# EAGLE schematic bat-board rev 2.1 (EAGLE 9.0.1)
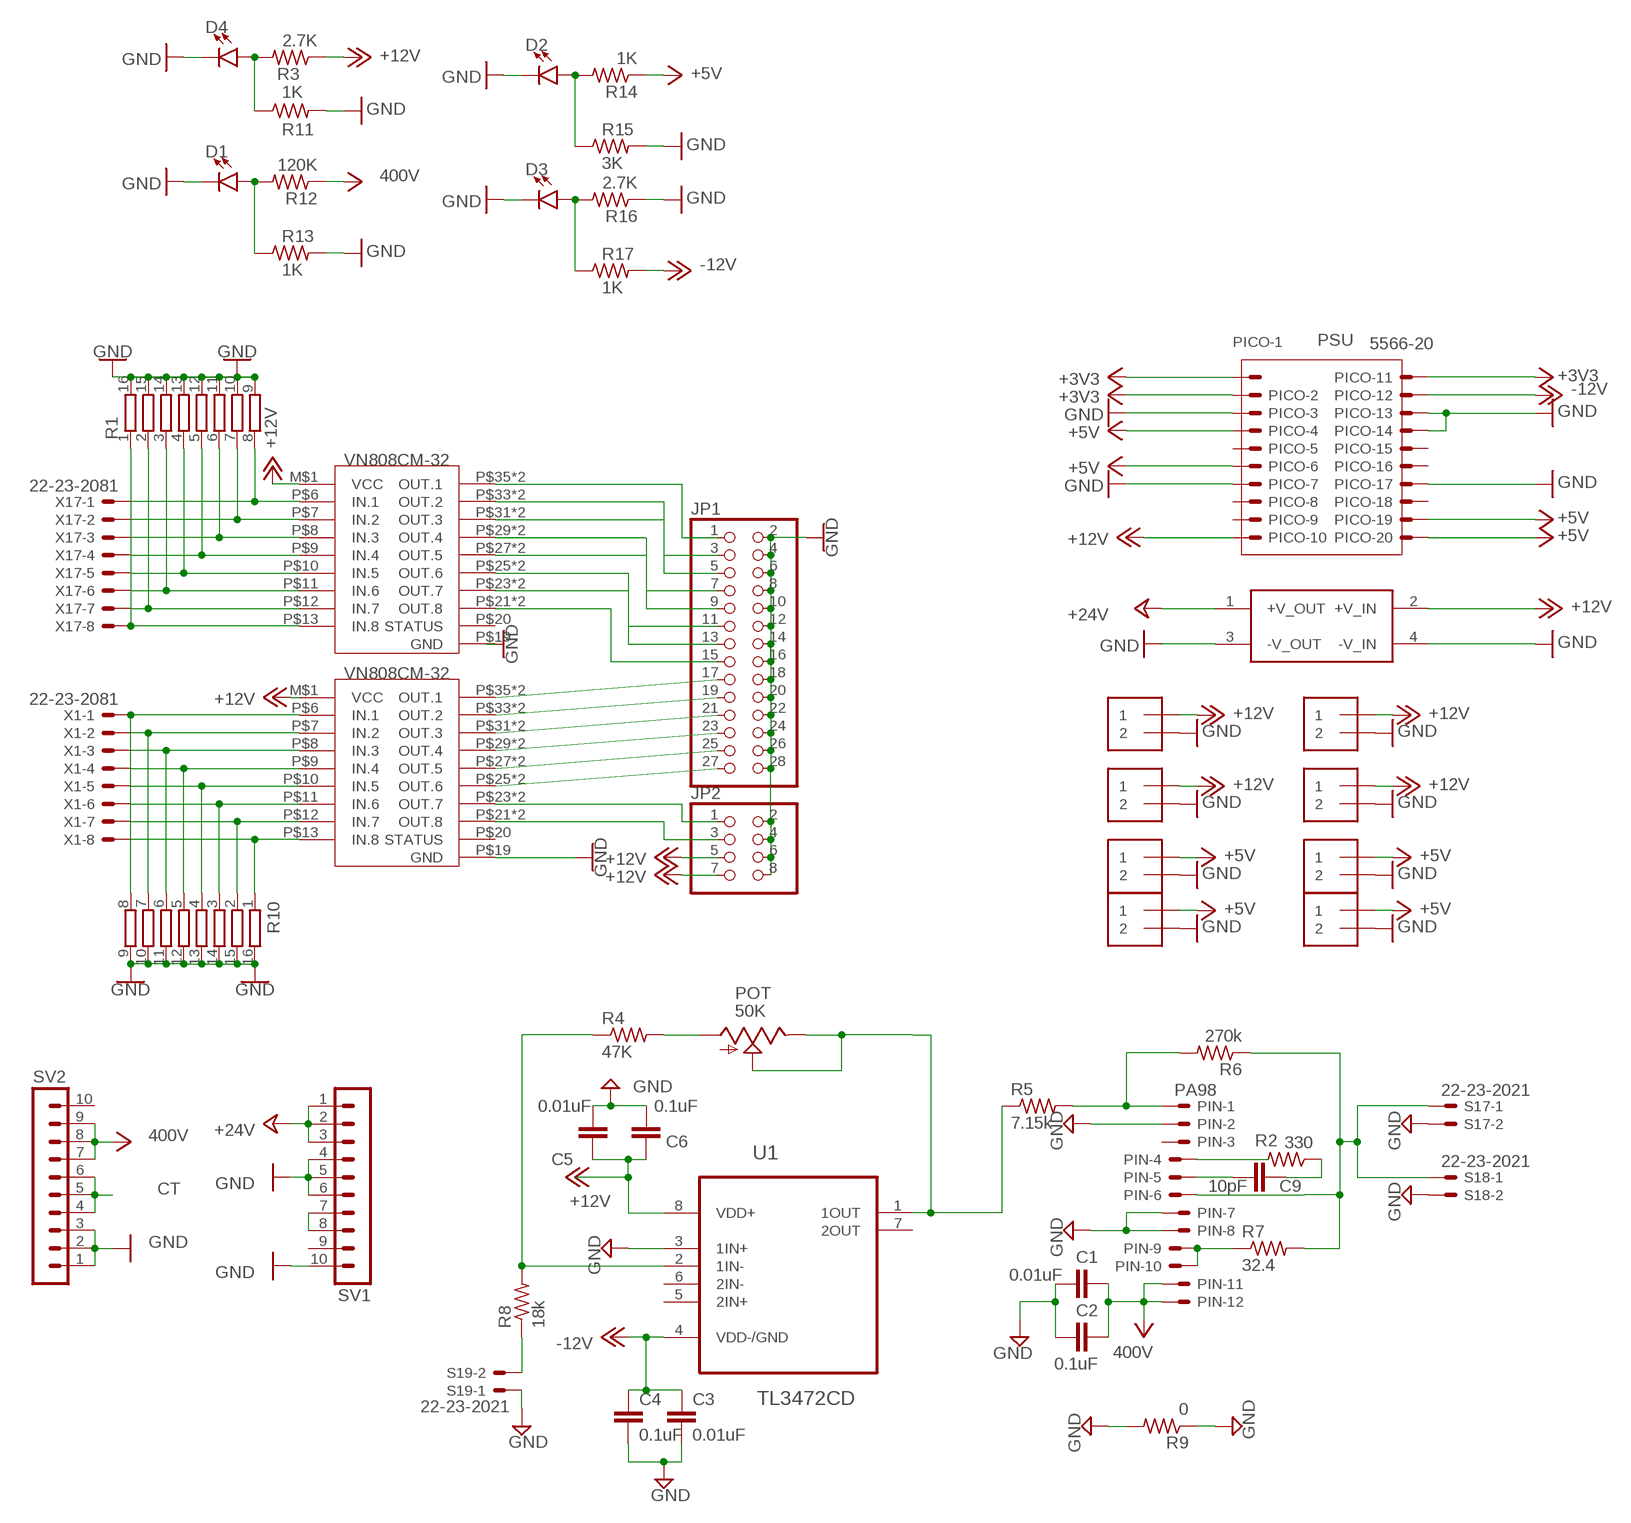
[diagram p0: schematic, sheet 1]

## Parts
$ZX1  12_DC-24_DC  [12_DC-24_DC]
C1  0.01uF  1.0UF-1206-50V-10%  [1206]
C2  0.1uF  1.0UF-1206-50V-10%  [1206]
C3  0.01uF  1.0UF-1206-50V-10%  [1206]
C4  0.1uF  1.0UF-1206-50V-10%  [1206]
C5  0.01uF  1.0UF-1206-50V-10%  [1206]
C6  0.1uF  1.0UF-1206-50V-10%  [1206]
C9  10pF  1.0UF-1206-50V-10%  [1206]
D1  LED1206  [LED-1206]
D2  LED1206  [LED-1206]
D3  LED1206  [LED-1206]
D4  LED1206  [LED-1206]
J1  1X2-3.5MM  [1X2-3.5MM]
J2  1X2-3.5MM  [1X2-3.5MM]
J3  1X2-3.5MM  [1X2-3.5MM]
J4  1X2-3.5MM  [1X2-3.5MM]
J5  1X2-3.5MM  [1X2-3.5MM]
J6  1X2-3.5MM  [1X2-3.5MM]
J7  1X2-3.5MM  [1X2-3.5MM]
J8  1X2-3.5MM  [1X2-3.5MM]
JP1  PINHD-2X14-CB  [2X14-CLEANBIG]
JP2  PINHD-2X4  [2X04]
PICO  5566-20  [5566-20]
PIN  PA98  22-23-2121  [22-23-2121]
POT  50K  TRIM_US-3223W  [3223W]
R1  4816P-T01  [4816P]
R2  330  R-US_M1206  [M1206]
R3  2.7K  R-US_M1206  [M1206]
R4  47K  R-US_M1206  [M1206]
R5  7.15k  R-US_M1206  [M1206]
R6  270k  R-US_M1206  [M1206]
R7  32.4  R-US_M1206  [M1206]
R8  18k  R-US_M1206  [M1206]
R9  0  R-US_M1206  [M1206]
R10  4816P-T01  [4816P]
R11  1K  R-US_M1206  [M1206]
R12  120K  R-US_M1206  [M1206]
R13  1K  R-US_M1206  [M1206]
R14  1K  R-US_M1206  [M1206]
R15  3K  R-US_M1206  [M1206]
R16  2.7K  R-US_M1206  [M1206]
R17  1K  R-US_M1206  [M1206]
S17  22-23-2021  [22-23-2021]
S18  22-23-2021  [22-23-2021]
S19  22-23-2021  [22-23-2021]
SV1  MA10-1  [MA10-1]
SV2  MA10-1  [MA10-1]
U1  TL3472CD  [SOIC127P600X175-8N]
U$3  VN808CM-32-E  [PSO36]
U$5  VN808CM-32-E  [PSO36]
X1  22-23-2081  [22-23-2081]
X17  22-23-2081  [22-23-2081]

## Nets
+3V3: PICO.1 PICO.2 PICO.11
+5V: J5.1 J6.1 J7.1 J8.1 PICO.4 PICO.6 PICO.19 PICO.20 R14.1
+12V: $ZX1.2(+V_IN) C5.1 C6.1 J1.1 J2.1 J3.1 J4.1 JP2.5 JP2.7 PICO.10 R3.1 U1.8(VDD+) U$3.M$1(VCC) U$5.M$1(VCC)
+24V: $ZX1.1(+V_OUT) SV1.1 SV1.2 SV1.3
-12V: C3.1 C4.1 PICO.12 R17.2 U1.4(VDD-/GND)
CT: SV2.4 SV2.5 SV2.6
GND: $ZX1.3(-V_OUT) $ZX1.4(-V_IN) C1.2 C2.2 C3.2 C4.2 C5.2 C6.2 D1.C D2.C D3.C D4.C J1.2 J2.2 J3.2 J4.2 J5.2 J6.2 J7.2 J8.2 JP1.2 JP1.4 JP1.6 JP1.8 JP1.10 JP1.12 JP1.14 JP1.16 JP1.18 JP1.20 JP1.22 JP1.24 JP1.26 JP1.28 JP2.2 JP2.4 JP2.6 JP2.8 PICO.3 PICO.7 PICO.13 PICO.14 PICO.17 PIN.2 PIN.7 PIN.8 R1.9 R1.10 R1.11 R1.12 R1.13 R1.14 R1.15 R1.16 R9.1 R9.2 R10.9 R10.10 R10.11 R10.12 R10.13 R10.14 R10.15 R10.16 R11.2 R13.2 R15.2 R16.1 S17.2 S18.2 S19.1 SV1.4 SV1.5 SV1.6 SV1.10 SV2.1 SV2.2 SV2.3 U1.3(1IN+) U$3.P$19(GND) U$5.P$19(GND)
N$1: R1.8 U$5.P$6(IN.1) X17.1
N$2: R1.7 U$5.P$7(IN.2) X17.2
N$5: JP1.1 U$5.P$35(OUT.1) U$5.P$36(OUT.1)
N$6: C9.1 R2.1
N$7: JP1.3 U$5.P$33(OUT.2) U$5.P$34(OUT.2)
N$8: JP1.5 U$5.P$31(OUT.3) U$5.P$32(OUT.3)
N$9: JP1.7 U$5.P$29(OUT.4) U$5.P$30(OUT.4)
N$10: JP1.9 U$5.P$27(OUT.5) U$5.P$28(OUT.5)
N$11: R4.1 R8.2 U1.2(1IN-)
N$12: SV1.7 SV1.8
N$13: JP1.11 U$5.P$25(OUT.6) U$5.P$26(OUT.6)
N$14: JP1.13 U$5.P$23(OUT.7) U$5.P$24(OUT.7)
N$15: JP1.15 U$5.P$21(OUT.8) U$5.P$22(OUT.8)
N$16: JP1.17 U$3.P$35(OUT.1) U$3.P$36(OUT.1)
N$17: JP1.19 U$3.P$33(OUT.2) U$3.P$34(OUT.2)
N$18: JP1.21 U$3.P$31(OUT.3) U$3.P$32(OUT.3)
N$19: JP1.23 U$3.P$29(OUT.4) U$3.P$30(OUT.4)
N$20: JP1.25 U$3.P$27(OUT.5) U$3.P$28(OUT.5)
N$21: JP1.27 U$3.P$25(OUT.6) U$3.P$26(OUT.6)
N$22: JP2.1 U$3.P$23(OUT.7) U$3.P$24(OUT.7)
N$23: JP2.3 U$3.P$21(OUT.8) U$3.P$22(OUT.8)
N$25: D4.A R3.2 R11.1
N$26: D1.A R12.2 R13.1
N$27: D2.A R14.2 R15.1
N$28: D3.A R16.2 R17.1
N$30: R10.8 U$3.P$6(IN.1) X1.1
N$31: POT.2(S) POT.3(E) R5.1 U1.1(1OUT)
N$32: R1.1 U$5.P$13(IN.8) X17.8
N$33: R1.2 U$5.P$12(IN.7) X17.7
N$34: PIN.6 R6.1 R7.2 S17.1 S18.1
N$35: R1.6 U$5.P$8(IN.3) X17.3
N$36: R1.3 U$5.P$11(IN.6) X17.6
N$37: R1.4 U$5.P$10(IN.5) X17.5
N$38: R1.5 U$5.P$9(IN.4) X17.4
N$39: R10.1 U$3.P$13(IN.8) X1.8
N$40: R10.2 U$3.P$12(IN.7) X1.7
N$41: R10.7 U$3.P$7(IN.2) X1.2
N$42: R10.6 U$3.P$8(IN.3) X1.3
N$43: R10.3 U$3.P$11(IN.6) X1.6
N$44: R10.4 U$3.P$10(IN.5) X1.5
N$45: R10.5 U$3.P$9(IN.4) X1.4
N$47: PIN.1 R5.2 R6.2
N$48: PIN.9 PIN.10 R7.1
N$49: PIN.4 R2.2
N$52: R8.1 S19.2
N$58: POT.1(A) R4.2
N$59: C9.2 PIN.5
V+: C1.1 C2.1 PIN.11 PIN.12 R12.1 SV2.7 SV2.8 SV2.9 ; supply symbol labelled 400V
Unconnected: PICO.5 PICO.8 PICO.9 PICO.15 PICO.16 PICO.18 PIN.3 SV1.9 SV2.10 U1.5(2IN+) U1.6(2IN-) U1.7(2OUT) U$3.P$20(STATUS) U$5.P$20(STATUS)

## Notes on the sheet
- PSU

## Library data of the parts
$ZX1 = Lucas Library:12_DC-24_DC
C1 C3 C5 = SparkFun-Capacitors:1.0UF: 1µF ceramic capacitors A capacitor is a passive two-terminal electrical component used to store electrical energy temporarily in an electric field.; MF: KEMET; MPN: C0805C103K1RACTU; OC_FARNELL: 1414661; PROD_ID: CAP-09822; VALUE: 1.0uF
C2 C4 C6 = SparkFun-Capacitors:1.0UF: 1µF ceramic capacitors A capacitor is a passive two-terminal electrical component used to store electrical energy temporarily in an electric field.; MF: KEMET; MPN: C0805C104J5RACTU; OC_FARNELL: 1414663; PROD_ID: CAP-09822; VALUE: 1.0uF
C9 = SparkFun-Capacitors:1.0UF: 1µF ceramic capacitors A capacitor is a passive two-terminal electrical component used to store electrical energy temporarily in an electric field.; MF: KEMET; MPN: C0805C479C5GACTU; OC_FARNELL: 1800809; PROD_ID: CAP-09822; VALUE: 1.0uF
D1-D4 = SparkFun-LED:LED: LED (Generic) Standard schematic elements and footprints for 5mm, 3mm, 1206, and 0603 sized LEDs. Generic LEDs with no color specified.
J1-J8 = adafruit:1X2: 3.5mm Terminal block http://www.ladyada.net/library/pcb/eaglelibrary.html
JP1 = adafruit:PINHD-2X14: PIN HEADER
JP2 = adafruit:PINHD-2X4: PIN HEADER
PICO = con-molex:5566-20: Mini FIT connector 20 pol ATX PC-Motherboard Power connector Source: http://www.molex.com; OC_FARNELL: unknown; OC_NEWARK: unknown
PIN = con-molex:22-23-2121: .100" (2.54mm) Center Header - 12 Pin; OC_FARNELL: unknown; OC_NEWARK: 56H0456
POT = pot:TRIM_US-: POTENTIOMETER
R1 R10 = resistor-bourns:4816P-T01: BOURNS RESISTOR NETWORK; MF: BOURNS, INC.; MPN: 4816P-T01-684LF; OC_FARNELL: 9357483; OC_NEWARK: 33K0707
R2 R7 R9 = adafruit:R-US_: RESISTOR, American symbol; MF: PANASONIC ELECTRONIC COMPONENTS; MPN: ERJ8ENF32R4V; OC_FARNELL: 2307627
R3 R8 R11-R17 = adafruit:R-US_: RESISTOR, American symbol; MF: WELWYN; MPN: WCR0805-18KFI; OC_FARNELL: 1100322
R4 = adafruit:R-US_: RESISTOR, American symbol; MF: KOA SPEAR ELECTRONICS; MPN: SG73S2ATTD9102F; OC_FARNELL: 1400374
R5 = adafruit:R-US_: RESISTOR, American symbol; MF: VISHAY; MPN: CRCW08057K15FKEA; OC_FARNELL: 1152455
R6 = adafruit:R-US_: RESISTOR, American symbol; MF: WELWYN; MPN: WCR0805-270KFI; OC_FARNELL: 1100330RL
S17-S19 = con-molex:22-23-2021: .100" (2.54mm) Center Header - 2 Pin; MF: MOLEX; MPN: 22-23-2021; OC_FARNELL: 1462926; OC_NEWARK: 25C3832
SV1 SV2 = con-lstb:MA10-1: PIN HEADER; OC_FARNELL: unknown; OC_NEWARK: unknown
U1 = TL3472CD:TL3472CD: HIGH-SLEW-RATE, SINGLE-SUPPLY OPERATIONAL AMPLIFIER; AVAILABILITY: Good; DESCRIPTION: High-Slew- ate, Single-Supply Operational Amplifier 8-SOIC 0 to 70; MF: Texas Instruments; MP: TL3472CD; OC_FARNELL: unknown; PACKAGE: SOIC-8 Texas Instruments; PRICE: 0.47 USD
U$3 U$5 = powersupplybatbot:VN808CM-32-E
X1 X17 = con-molex:22-23-2081: .100" (2.54mm) Center Header - 8 Pin; MF: MOLEX; MPN: 22-23-2081; OC_FARNELL: 1756826; OC_NEWARK: 01C7592